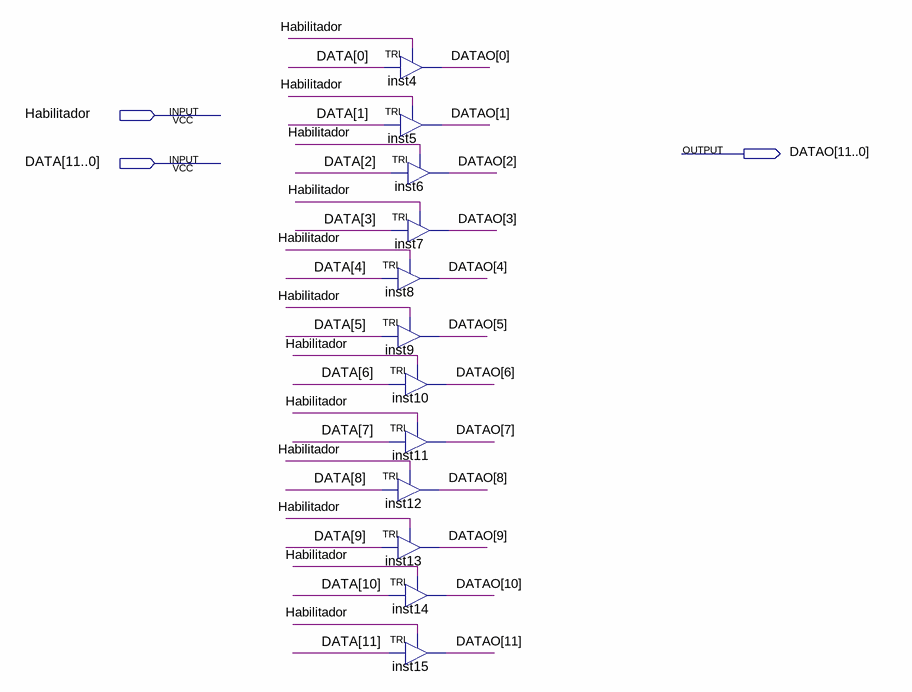
[diagram p0: schematic sheet]
// Quartus schematic TRI11B.bdf as structural Verilog: 12 symbols, 3 pins
module TRI11B (
  input  Habilitador,
  input  [11:0] DATA,
  output [11:0] DATAO
);

  TRI inst8 (.IN(DATA[4]), .OE(Habilitador), .OUT(DATAO[4]));
  TRI inst9 (.IN(DATA[5]), .OE(Habilitador), .OUT(DATAO[5]));
  TRI inst12 (.IN(DATA[8]), .OE(Habilitador), .OUT(DATAO[8]));
  TRI inst13 (.IN(DATA[9]), .OE(Habilitador), .OUT(DATAO[9]));
  TRI inst4 (.IN(DATA[0]), .OE(Habilitador), .OUT(DATAO[0]));
  TRI inst5 (.IN(DATA[1]), .OE(Habilitador), .OUT(DATAO[1]));
  TRI inst6 (.IN(DATA[2]), .OE(Habilitador), .OUT(DATAO[2]));
  TRI inst7 (.IN(DATA[3]), .OE(Habilitador), .OUT(DATAO[3]));
  TRI inst10 (.IN(DATA[6]), .OE(Habilitador), .OUT(DATAO[6]));
  TRI inst11 (.IN(DATA[7]), .OE(Habilitador), .OUT(DATAO[7]));
  TRI inst14 (.IN(DATA[10]), .OE(Habilitador), .OUT(DATAO[10]));
  TRI inst15 (.IN(DATA[11]), .OE(Habilitador), .OUT(DATAO[11]));
endmodule
